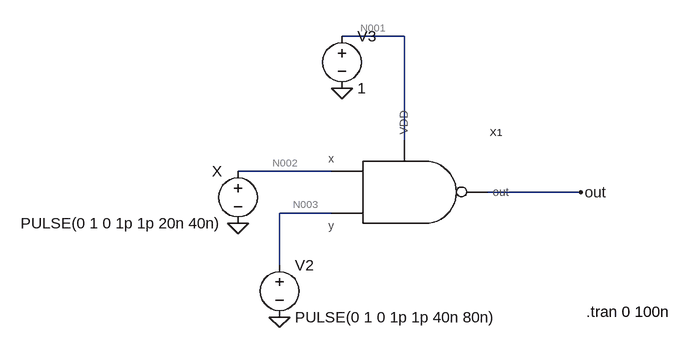
[diagram p0: schematic nand_test.asc]
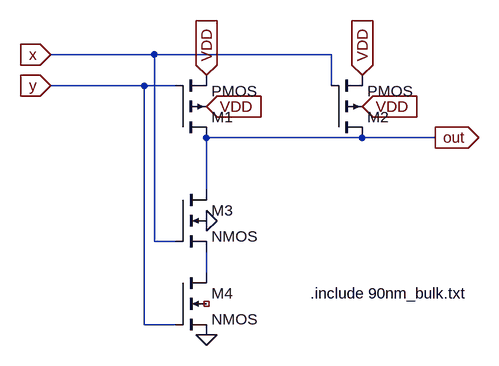
[diagram p1: sub-circuit nand.asc]
nand_test.asc, the LTspice schematic file:
Version 4.1
SHEET 1 880 680
WIRE 192 -80 96 -80
WIRE 192 80 192 -80
WIRE 80 128 -64 128
WIRE 464 160 320 160
WIRE 80 192 0 192
WIRE 0 272 0 192
FLAG 464 160 out
FLAG 96 0 0
FLAG 0 352 0
FLAG -64 208 0
SYMBOL nand 176 160 R0
SYMATTR InstName X1
SYMBOL voltage -64 112 M0
WINDOW 123 0 0 Left 0
WINDOW 39 0 0 Left 0
SYMATTR InstName X
SYMATTR Value PULSE(0 1 0 1p 1p 20n 40n)
SYMBOL voltage 0 256 R0
WINDOW 123 0 0 Left 0
WINDOW 39 0 0 Left 0
SYMATTR InstName V2
SYMATTR Value PULSE(0 1 0 1p 1p 40n 80n)
SYMBOL voltage 96 -96 R0
SYMATTR InstName V3
SYMATTR Value 1
TEXT 472 344 Left 2 !.tran 0 100n

nand.asc, the sub-circuit schematic file:
Version 4.1
SHEET 1 880 680
WIRE 96 32 -64 32
WIRE 368 32 96 32
WIRE 80 80 -64 80
WIRE 128 80 80 80
WIRE 368 80 368 32
WIRE 416 160 176 160
WIRE 528 160 416 160
WIRE 176 240 176 160
WIRE 96 320 96 32
WIRE 128 320 96 320
WIRE 176 368 176 336
WIRE 80 448 80 80
WIRE 128 448 80 448
FLAG 176 464 0
FLAG 176 288 0
FLAG -64 80 y
IOPIN -64 80 In
FLAG -64 32 x
IOPIN -64 32 In
FLAG 416 64 VDD
IOPIN 416 64 In
FLAG 416 112 VDD
IOPIN 416 112 In
FLAG 176 112 VDD
IOPIN 176 112 In
FLAG 176 64 VDD
IOPIN 176 64 In
FLAG 528 160 out
IOPIN 528 160 Out
SYMBOL pmos4 128 160 M180
SYMATTR InstName M1
SYMBOL pmos4 368 160 M180
SYMATTR InstName M2
SYMBOL nmos4 128 240 R0
SYMATTR InstName M3
SYMBOL nmos4 128 368 R0
SYMATTR InstName M4
TEXT 336 400 Left 2 !.include 90nm_bulk.txt

The netlist it stands for:
* nand_test.asc
X§X1 N002 N003 out N001 nand
V§X N002 0 PULSE(0 1 0 1p 1p 20n 40n)
V2 N003 0 PULSE(0 1 0 1p 1p 40n 80n)
V3 N001 0 1

* block symbol definitions
.subckt nand x y out VDD
M1 out y VDD VDD PMOS
M2 out x VDD VDD PMOS
M3 out x N001 0 NMOS
M4 N001 y 0 NC_01 NMOS
.include 90nm_bulk.txt
.ends nand

.model NMOS NMOS
.model PMOS PMOS
.lib standard.mos
.tran 0 100n
.backanno
.end

* Results of the author's LTspice run, read from the files saved beside the schematic
* Operating Point, zero values left out:
*   V(n001) = 1 V
*   V(out) = 1 V
*   I(V2) = 85.44 pA
*   I(V3) = -3.576 nA
*   I(X) = 3.446 nA
*   Ix(x1:vdd) = 3.576 nA
*   Ix(x1:x) = -3.446 nA
*   Ix(x1:y) = -85.44 pA
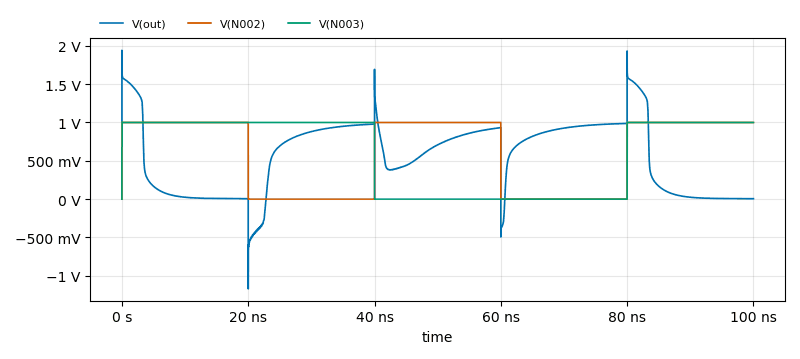
[diagram p2: Transient Analysis of nand_test.asc, plotted from the saved traces]
* Transient Analysis, 1 run:
*   V(out): min -1.17 V, max 1.941 V, average 560.7 mV, rms 736 mV, last 5.656 mV
*   V(N002): min 0 V, max 1 V, average 600 mV, rms 774.6 mV, last 1 V
*   V(N003): min 0 V, max 1 V, average 600 mV, rms 774.6 mV, last 1 V